# EAGLE design LED_addon_v6 (EAGLE 6.0)
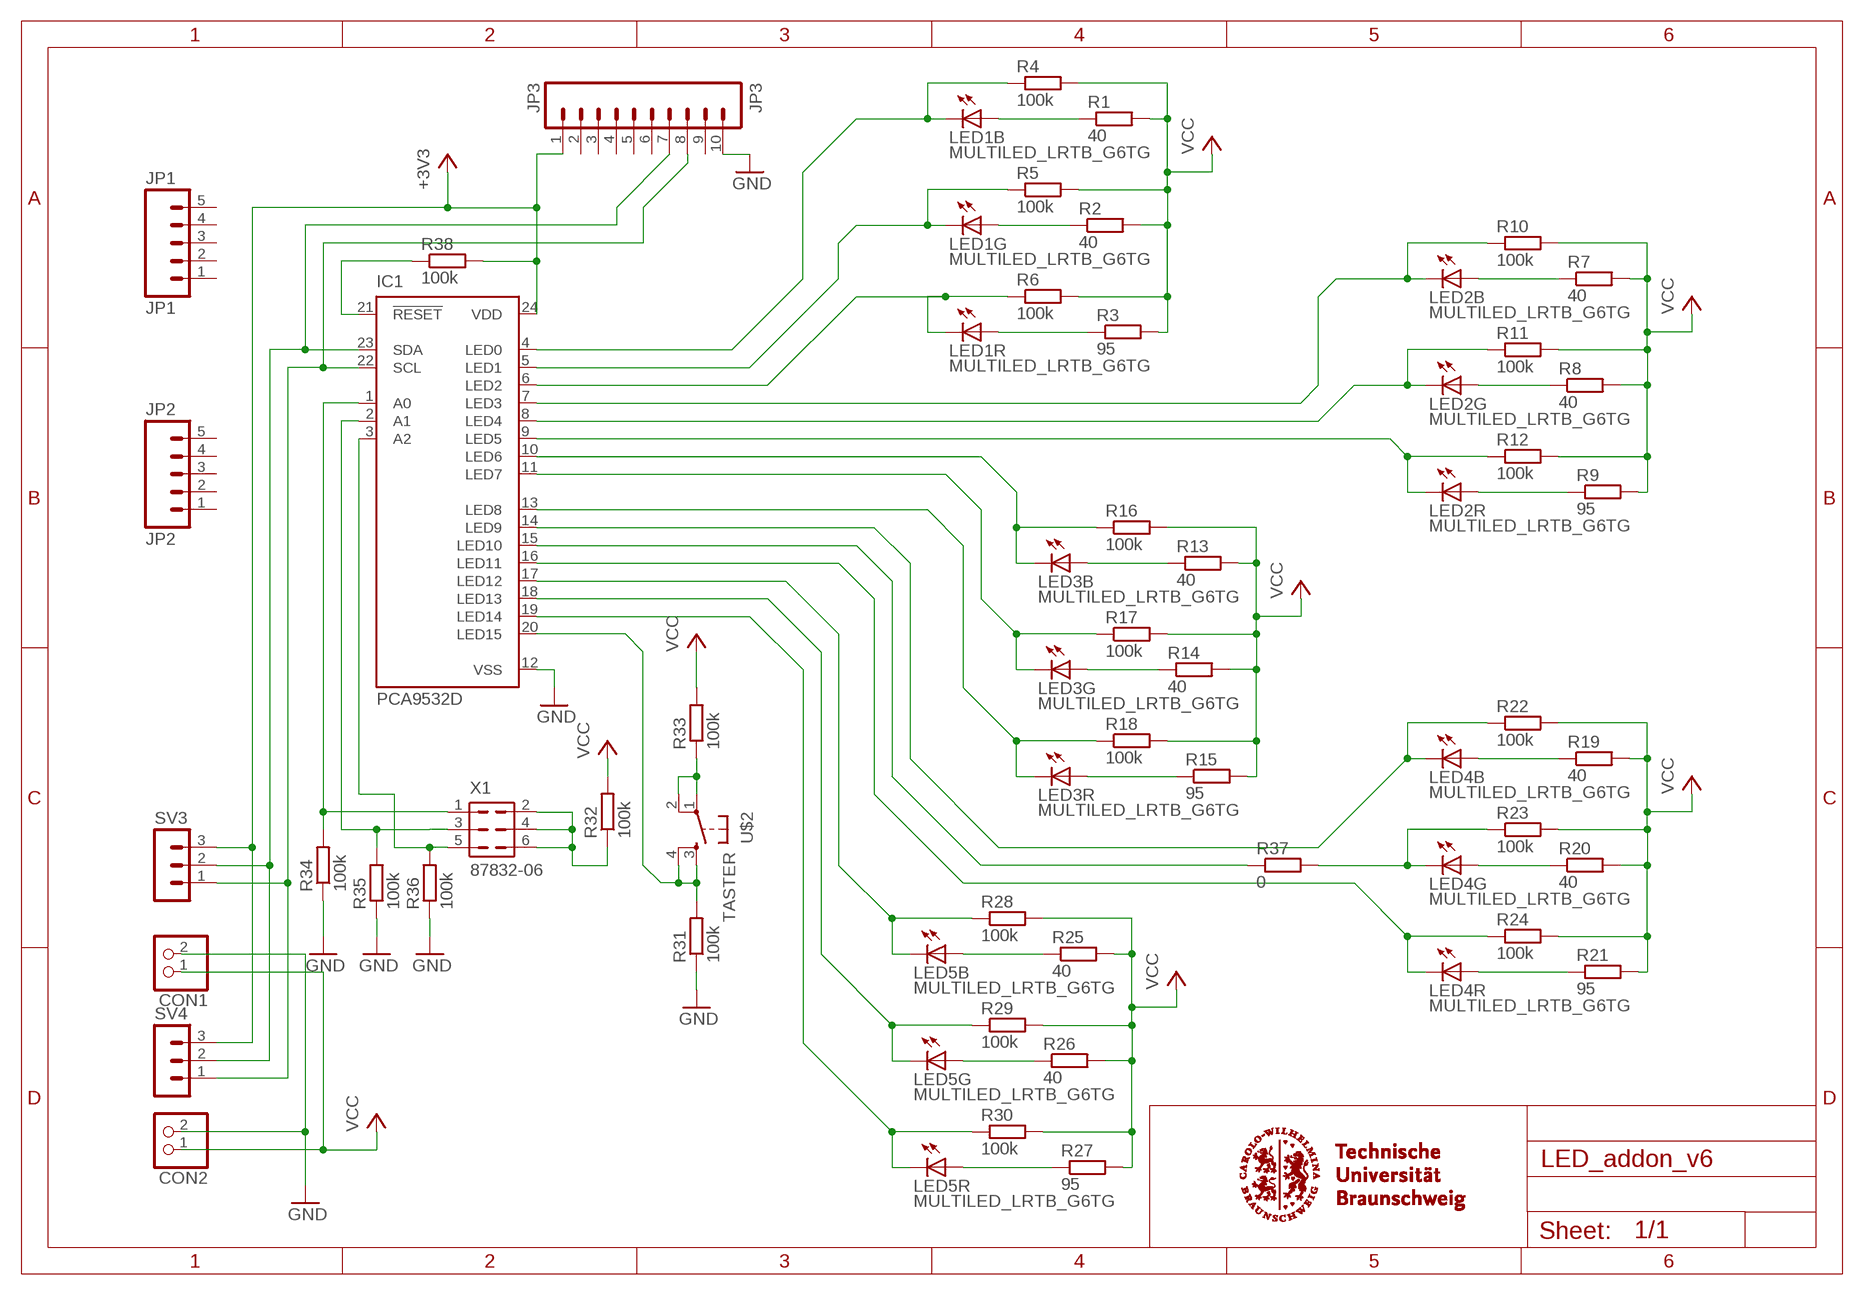
[diagram p0: schematic, sheet 1]

## Parts
CON1  PINHD-1X2  [1X02]
CON2  PINHD-1X2  [1X02]
IC1  PCA9532D  [SO24]
JP1  JP1  M05PTH  [1X05]
JP2  JP2  M05PTH  [1X05]
JP3  JP3  M10"  [1X10]
LED1  MULTILED_LRTB_G6TG  [P-LCC-6_TOPLED]
LED2  MULTILED_LRTB_G6TG  [P-LCC-6_TOPLED]
LED3  MULTILED_LRTB_G6TG  [P-LCC-6_TOPLED]
LED4  MULTILED_LRTB_G6TG  [P-LCC-6_TOPLED]
LED5  MULTILED_LRTB_G6TG  [P-LCC-6_TOPLED]
R1  40  R-EU_M0805  [M0805]
R2  40  R-EU_M0805  [M0805]
R3  95  R-EU_M0805  [M0805]
R4  100k  R-EU_M0805  [M0805]
R5  100k  R-EU_M0805  [M0805]
R6  100k  R-EU_M0805  [M0805]
R7  40  R-EU_M0805  [M0805]
R8  40  R-EU_M0805  [M0805]
R9  95  R-EU_M0805  [M0805]
R10  100k  R-EU_M0805  [M0805]
R11  100k  R-EU_M0805  [M0805]
R12  100k  R-EU_M0805  [M0805]
R13  40  R-EU_M0805  [M0805]
R14  40  R-EU_M0805  [M0805]
R15  95  R-EU_M0805  [M0805]
R16  100k  R-EU_M0805  [M0805]
R17  100k  R-EU_M0805  [M0805]
R18  100k  R-EU_M0805  [M0805]
R19  40  R-EU_M0805  [M0805]
R20  40  R-EU_M0805  [M0805]
R21  95  R-EU_M0805  [M0805]
R22  100k  R-EU_M0805  [M0805]
R23  100k  R-EU_M0805  [M0805]
R24  100k  R-EU_M0805  [M0805]
R25  40  R-EU_M0805  [M0805]
R26  40  R-EU_M0805  [M0805]
R27  95  R-EU_M0805  [M0805]
R28  100k  R-EU_M0805  [M0805]
R29  100k  R-EU_M0805  [M0805]
R30  100k  R-EU_R0603  [R0603]
R31  100k  R-EU_M0805  [M0805]
R32  100k  R-EU_M0805  [M0805]
R33  100k  R-EU_M0805  [M0805]
R34  100k  R-EU_M0805  [M0805]
R35  100k  R-EU_M0805  [M0805]
R36  100k  R-EU_M0805  [M0805]
R37  0  R-EU_M1206  [M1206]
R38  100k  R-EU_M0805  [M0805]
SV3  MA03-1  [MA03-1]
SV4  MA03-1  [MA03-1]
U$2  TASTER  [TASTER]
X1  87832-06  [87832-06]

## Nets
+3V3: IC1.24(VDD) JP3.1 R38.2 SV3.3 SV4.3
A0: IC1.1(A0) R34.2 X1.1
A1: IC1.2(A1) R35.2 X1.3
A2: IC1.3(A2) R36.2 X1.5
GND: CON1.2 CON2.2 IC1.12(VSS) JP3.10 R31.1 R34.1 R35.1 R36.1
LED1B: IC1.4(LED0) LED1.C3(B:C) R4.1
LED1G: IC1.5(LED1) LED1.C2(G:C) R5.1
LED1R: IC1.6(LED2) LED1.C1(R:C) R6.1
LED2B: IC1.7(LED3) LED2.C3(B:C) R10.1
LED2G: IC1.8(LED4) LED2.C2(G:C) R11.1
LED2R: IC1.9(LED5) LED2.C1(R:C) R12.1
LED3B: IC1.10(LED6) LED3.C3(B:C) R16.1
LED3G: IC1.11(LED7) LED3.C2(G:C) R17.1
LED3R: IC1.13(LED8) LED3.C1(R:C) R18.1
LED4B: IC1.14(LED9) LED4.C3(B:C) R22.1
LED4G: IC1.15(LED10) R37.1
LED4G2: LED4.C2(G:C) R23.1 R37.2
LED4R: IC1.16(LED11) LED4.C1(R:C) R24.1
LED5B: IC1.17(LED12) LED5.C3(B:C) R28.1
LED5G: IC1.18(LED13) LED5.C2(G:C) R29.1
LED5R: IC1.19(LED14) LED5.C1(R:C) R30.1
N$1: LED1.A3(B:A) R1.1
N$2: LED1.A2(G:A) R2.1
N$3: LED1.A1(R:A) R3.1
N$4: IC1.21(!RESET) R38.1
N$5: R33.1 U$2.1(P) U$2.2(P1)
N$7: R32.1 X1.2 X1.4 X1.6
N$10: LED2.A3(B:A) R7.1
N$11: LED2.A2(G:A) R8.1
N$12: LED2.A1(R:A) R9.1
N$19: LED3.A3(B:A) R13.1
N$20: LED3.A2(G:A) R14.1
N$23: LED3.A1(R:A) R15.1
N$25: LED4.A3(B:A) R19.1
N$26: LED4.A2(G:A) R20.1
N$27: LED4.A1(R:A) R21.1
N$35: LED5.A3(B:A) R25.1
N$36: LED5.A2(G:A) R26.1
N$37: LED5.A1(R:A) R27.1
SCL: IC1.22(SCL) JP3.8 SV3.1 SV4.1
SDA: IC1.23(SDA) JP3.7 SV3.2 SV4.2
SWITCH: IC1.20(LED15) R31.2 U$2.3(S) U$2.4(S1)
VCC: CON1.1 CON2.1 R1.2 R2.2 R3.2 R4.2 R5.2 R6.2 R7.2 R8.2 R9.2 R10.2 R11.2 R12.2 R13.2 R14.2 R15.2 R16.2 R17.2 R18.2 R19.2 R20.2 R21.2 R22.2 R23.2 R24.2 R25.2 R26.2 R27.2 R28.2 R29.2 R30.2 R32.2 R33.2
Unconnected: JP1.1 JP1.2 JP1.3 JP1.4 JP1.5 JP2.1 JP2.2 JP2.3 JP2.4 JP2.5 JP3.2 JP3.3 JP3.4 JP3.5 JP3.6 JP3.9

## Library data of the parts
CON1 CON2 = pinhead:PINHD-1X2: PIN HEADER
IC1 = PCA9532:PCA9532: 16-bit i2C-bus LED dimmer The PCA9532 is a 16-bit I2C-bus and SMBus I/O expander optimized for dimming LEDs in 256 discrete steps for Red/Green/Blue (RGB) color mixing and back light applications. The PCA9532 contains an internal oscillator with two user programmable blink rates and duty cycles coupled to the output PWM. The LED brightness is controlled by setting the blink rate high enough (> 100 Hz) that the blinking cannot be seen and then using the duty cycle to vary the amount of time the LED is on and thus the average current through the LED.
JP1 JP2 = SparkFun:M05: Header 5 Standard 5-pin 0.1" header. Use with straight break away headers (SKU : PRT-00116), right angle break away headers (PRT-00553), swiss pins (PRT-00743), machine pins (PRT-00117), and female headers (PRT-00115). Molex polarized connector foot print use with SKU : PRT-08230 with associated crimp pins and housings.
JP3 = SparkFun:M10: Header 10 Standard 10-pin 0.1" header. Use with straight break away headers (SKU : PRT-00116), right angle break away headers (PRT-00553), swiss pins (PRT-00743), machine pins (PRT-00117), and female headers (PRT-00115).
LED1-LED5 = led:MULTILED_LRTB_G6TG: 6-lead MULTILED® Enhanced optical Power LED (ThinFilm® / ThinGaN®) Source. OSRAM - LRTB_G6TG.pdf
R1-R38 = resistor:R-EU_: RESISTOR, European symbol
SV3 SV4 = con-lstb:MA03-1: PIN HEADER
U$2 = taster:TASTER: SMD Switch
X1 = con-molex:87832-06: Milli-Grid Header 2.00mm (.079") Pitch

## Board
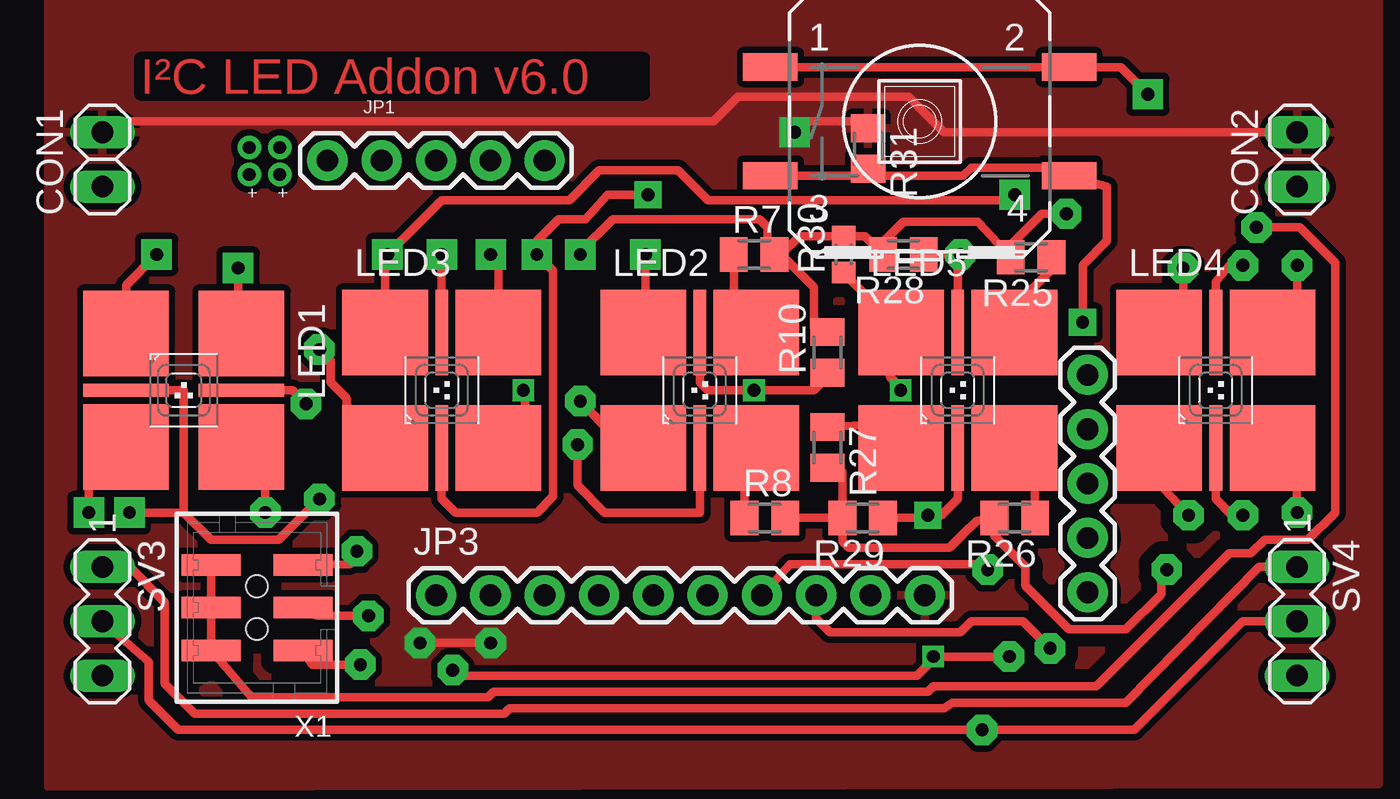
[diagram p1: board, top side]
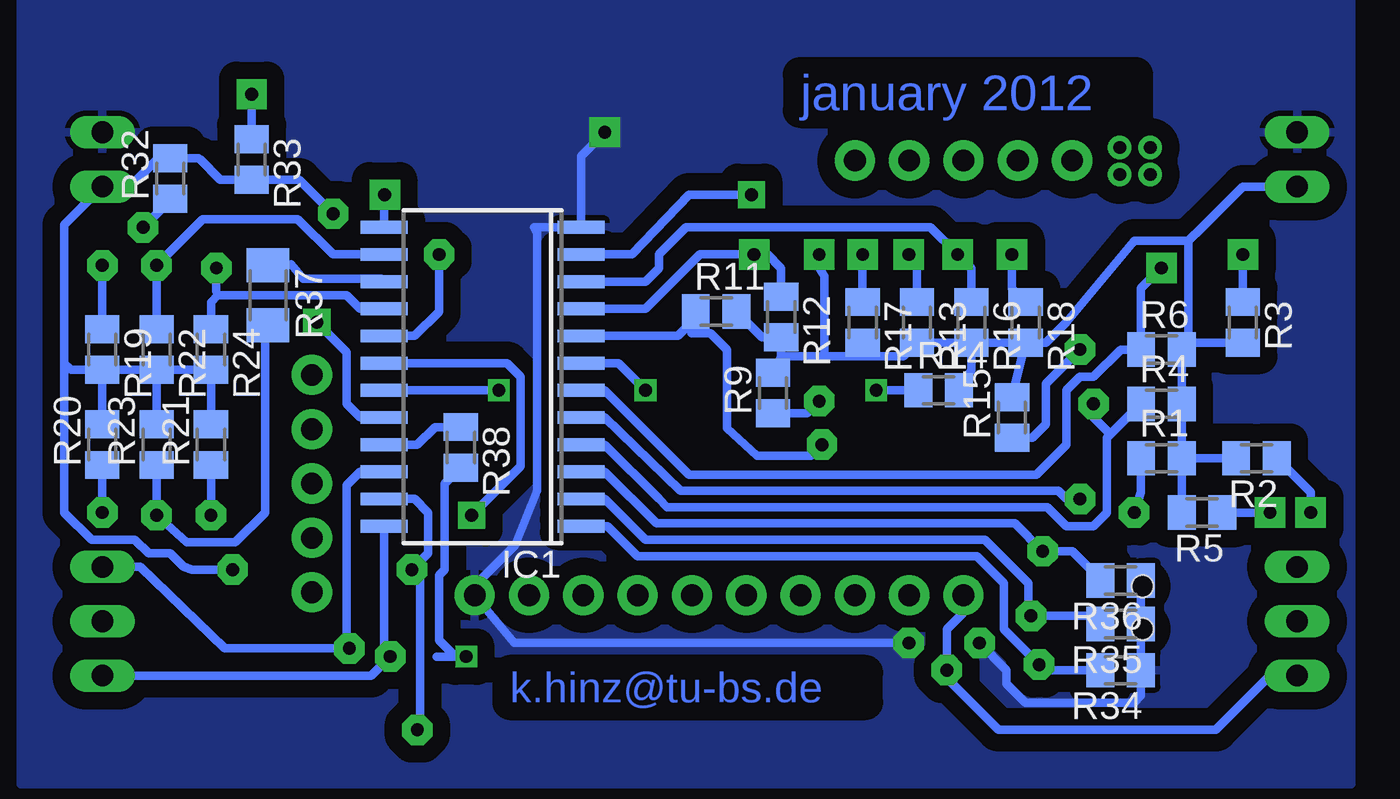
[diagram p2: board, bottom side, seen from below]

No outline drawn. Coordinates in mm, seen from the top.
Copper layers (1*16): Top 0.035mm / dielectric 1.5mm / Bottom 0.035mm
Design rules: minimum track width 16mil, minimum drill 32mil, track to track 12mil, track to pad 12mil, pad to pad 12mil, via to via 12mil, smd to smd 12mil, copper to edge 25mil, drill to drill 12mil, minimum pad ring 10mil, minimum via ring 8mil, stop-mask expansion 4mil, vias tented up to drill 0mil, thermal gap 10mil

### Footprints (pad centres in the part's own frame; a part is rotated, then mirrored left to right if it is on the bottom)
1X02 = drill 1.016 long: 1 -1.27,0; 2 1.27,0
SO24 = smd 0.6 x 2.2: 1 -6.985,-4.6; 2 -5.715,-4.6; 3 -4.445,-4.6; 4 -3.175,-4.6; 5 -1.905,-4.6; 6 -0.635,-4.6; 7 0.635,-4.6; 8 1.905,-4.6; 9 3.175,-4.6; 10 4.445,-4.6; 11 5.715,-4.6; 12 6.985,-4.6; 13 6.985,4.6; 14 5.715,4.6; 15 4.445,4.6; 16 3.175,4.6; 17 1.905,4.6; 18 0.635,4.6; 19 -0.635,4.6; 20 -1.905,4.6; 21 -3.175,4.6; 22 -4.445,4.6; 23 -5.715,4.6; 24 -6.985,4.6
1X05@1 = drill 1.016 pad 1.88: 1 0,0; 2 2.54,0; 3 5.08,0; 4 7.62,0; 5 10.16,0
1X10 = drill 1.016 pad 1.88: 1 0,0; 2 2.54,0; 3 5.08,0; 4 7.62,0; 5 10.16,0; 6 12.7,0; 7 15.24,0; 8 17.78,0; 9 20.32,0; 10 22.86,0
BATT = drill 0.6 pad 1.016: BATT_+ 0,0; BATT_GND 1.27,0
P-LCC-6_TOPLED = smd 4 x 4: A1 -2.65,-2.7; A2 2.65,-2.7; A3 2.65,2.7; C1 -2.65,2.7 | smd 0.6 x 4: C2 0,-2.7; C3 0,2.7
M0805 = smd 1.3 x 1.6: 1 -0.95,0; 2 0.95,0
R0603 = smd 1 x 1.1: 1 -0.85,0; 2 0.85,0
M1206 = smd 1.6 x 2: 1 -1.4,0; 2 1.4,0
MA03-1 = drill 1.016 long: 1 -2.54,0; 2 0,0; 3 2.54,0
TASTER = smd 2.54 x 1.27: 1 -6.985,2.54; 2 6.985,2.54; 3 -6.985,-2.54; 4 6.985,-2.54
87832-06 = smd 1 x 2.75: 1 -2,-2.15; 2 -2,2.15; 3 0,-2.15; 4 0,2.15; 5 2,-2.15; 6 2,2.15 | hole 1: -1,0; 1,0

### Placement (x,y rotation side)
CON1  22.86,38.1 90 top
CON2  78.74,38.1 90 top
IC1  60.96,27.94 90 bottom
JP1  JP1  [1X05@1]  33.38,38.05 0 top
JP2  JP2  [1X05@1]  68.94,17.87 90 top
JP3  38.46,17.73 0 top
JP4  Batt  [BATT]  29.73,37.39 90 top
JP5  Li-Ion  [BATT]  31.16,37.39 90 top
LED1  26.67,27.3 270 top
LED2  50.8,27.3 0 top
LED3  38.73,27.3 0 top
LED4  74.93,27.3 0 top
LED5  62.87,27.3 0 top
R1  29.21,24.13 0 bottom
R2  24.77,24.13 180 bottom
R3  25.4,30.48 270 bottom
R4  29.21,26.67 0 bottom
R5  27.3,21.59 180 bottom
R6  29.21,29.21 0 bottom
R7  53.34,33.66 0 top
R8  53.85,21.34 0 top
R9  47.37,27.18 90 bottom
R10  56.77,29.08 90 top
R11  50.04,30.99 0 bottom
R12  46.99,30.73 270 bottom
R13  40.64,30.48 270 bottom
R14  39.62,27.3 0 bottom
R15  36.2,26.04 90 bottom
R16  38.1,30.48 270 bottom
R17  43.18,30.48 270 bottom
R18  35.56,30.48 270 bottom
R19  78.74,29.21 270 bottom
R20  78.74,24.77 90 bottom
R21  73.66,24.77 90 bottom
R22  76.2,29.21 270 bottom
R23  76.2,24.77 90 bottom
R24  73.66,29.21 270 bottom
R25  66.29,33.53 180 top
R26  65.53,21.34 180 top
R27  56.77,24.64 270 top
R28  60.33,33.66 180 top
R29  58.42,21.34 180 top
R30  57.53,33.66 90 top
R31  58.67,38.61 270 top
R32  75.56,37.21 90 bottom
R33  71.75,38.1 270 bottom
R34  31.11,14.22 180 bottom
R35  31.11,16.38 180 bottom
R36  31.11,18.41 180 bottom
R37  70.99,31.75 270 bottom
R38  61.98,24.64 270 bottom
SV3  22.86,16.51 270 top
SV4  78.74,16.51 270 top
U$2  61.09,39.88 0 top
X1  30.1,17.14 90 top

### Tracks (layer width: path | path; a pad name or v marks a point on that pad's centre or on a via)
+3V3  (via drill 0.6, 0.6 pad 1.42)
  Top 0.406: v65.28,14.86 v61.72,14.86 61.85,14.86 60.96,13.97 39.75,13.97 v39.24,14.22
  Bottom 0.406: 65.56,14.63 65.56,14.58 | 65.56,14.63 IC1.24 | 65.56,14.58 66.17,13.97 SV4.3 | SV3.3 24.13,13.97 26.67,11.43 36.83,11.43 39.24,13.84 v39.24,14.22 39.24,16.13 38.48,16.89 38.48,17.74 JP3.1 | 65.56,14.63 65.56,14.58 | v65.28,14.86 65.56,14.63 | R38.2 62.74,22.93 62.74,21.46 62.74,18.92 62.99,18.67 62.99,15.62 62.87,15.49 62.23,14.86 v61.72,14.86 63.12,14.86
A0  (via drill 0.6 pad 1.42)
  Top 0.406: X1.1 32.66,14.48 v34.92,14.48
  Bottom 0.406: IC1.1 55.12,20.95 53.72,19.56 38.73,19.56 37.85,19.56 36.58,18.29 36.58,16.13 v34.92,14.48 34.67,14.22 R34.2
A1  (via drill 0.6 pad 1.42)
  Top 0.406: X1.3 32.88,16.76 v35.31,16.76
  Bottom 0.406: IC1.2 55.24,22.23 53.34,20.32 39.37,20.32 37.47,20.32 35.43,18.29 35.43,16.89 v35.31,16.76 32.45,16.76 R35.2
A2  (via drill 0.6 pad 1.42)
  Top 0.406: X1.5 34.42,19.18 34.77,19.53 v34.77,19.78
  Bottom 0.406: IC1.3 55.24,23.5 52.83,21.08 39.88,21.08 36.07,21.08 v34.77,19.78 33.37,19.78 32.13,18.54 32.16,18.51 R36.2
GND  (via drill 0.6 pad 1.42)
  Top 0.406: 58.49,39.88 R31.1 | v41.02,15.49 40.26,15.49 v37.72,15.49 | 55.24,39.88 58.49,39.88 | 55.24,39.88 58.49,39.88 | v55.24,39.37 55.24,39.88 | CON1.2 23.37,39.88 45.59,39.88 51.44,39.88 52.58,41.02 60.58,41.02 60.96,40.64 62.23,39.37 CON2.2
  Bottom 0.406: R36.1 R35.1 R34.1 30.16,13.02 30.48,12.7 35.05,12.7 35.56,12.7 36.45,13.59 36.45,14.22 v37.72,15.49 | v55.24,39.37 56.36,38.26 IC1.12 58.55,34.92 58.42,34.67 58.42,22.61 59.44,20.07 61.32,18.18 JP3.10 59.47,15.49 v41.02,15.49
  pour Bottom (isolate 0.813): 20.32,46.99 82.55,46.99 82.55,8.89 20.32,8.89
  pour Top (isolate 0.305): 82.55,46.99 82.55,8.89 20.32,8.76 20.32,46.99
  pour Top (isolate 0.813): 20.32,46.99 82.55,46.99 82.55,8.89 20.32,8.89
LED1B  (via drill 0.6 pad 1.42)
  Top 0.406: LED1.C3 31.75,27.3 v32.38,26.67
  Bottom 0.406: IC1.4 55.24,24.77 52.7,22.23 52.32,21.84 34.54,21.84 33.66,20.95 32.38,20.95 31.75,21.59 31.75,24.13 31.75,25.08 31.59,25.24 | 31.59,25.24 R4.1 | v32.38,26.67 32.38,26.04 31.59,25.24
LED1G  (via drill 0.6 pad 1.42)
  Top 0.406: LED1.C2 26.67,27.3 26.67,22.86 26.67,21.59 | 26.67,21.59 27.94,20.32 29.21,20.32 30.48,20.32 31.11,20.32 v33.02,22.23 | v24.13,21.59 24.77,21.59 26.67,21.59
  Bottom 0.406: IC1.5 55.24,26.04 51.69,22.61 34.04,22.61 33.66,22.23 v33.02,22.23 | v24.13,21.59 R5.1
LED1R  (via drill 0.6 pad 1.42)
  Top 0.406: v29.21,33.02 29.21,30.11 LED1.C1
  Bottom 0.406: IC1.6 55.24,27.3 51.31,23.37 35.05,23.37 33.66,24.77 33.66,27.3 33.02,27.94 32.38,27.94 31.11,29.21 R6.1 30.16,32.07 v29.21,33.02
LED2B  (via drill 0.6 pad 1.02)
  Top 0.406: LED2.C3 50.8,27.69 51.18,27.3 v53.34,27.3 56.13,27.3 56.77,27.94 R10.1
  Bottom 0.406: IC1.7 54.61,28.57 v53.34,27.3
LED2G  (via drill 0.6 pad 1.42)
  Top 0.406: LED2.C2 50.8,21.59 46.35,21.59 45.09,22.86 v45.09,24.77
  Bottom 0.406: R11.1 50.99,30.48 50.8,30.48 50.8,31.37 51.18,31.37 51.18,30.48 | 51.18,30.48 51.18,29.97 50.29,29.97 49.53,29.21 49.53,25.53 48.13,24.26 45.85,24.26 45.59,24.26 v45.09,24.77 | IC1.8 51.82,29.84 51.18,30.48
LED2R  (via drill 0.6 pad 1.42)
  Top 0.406: v48.26,33.66 48.26,33.02 48.26,31.75 48.26,30.11 LED2.C1
  Bottom 0.406: IC1.9 53.34,31.11 50.8,33.66 v48.26,33.66 47.62,33.66 46.99,33.02 R12.1
LED3B  (via drill 0.6 pad 1.42)
  Top 0.406: LED3.C3 38.73,32.38 v38.73,33.66
  Bottom 0.406: IC1.10 53.34,32.38 52.7,33.02 52.7,33.66 51.44,34.92 45.09,34.92 40.01,34.92 v38.73,33.66 38.1,33.02 R16.1
LED3G  (via drill 0.6 pad 1.27, 0.6 pad 1.42)
  Top 0.406: LED3.C2 38.73,22.23 39.37,21.59 43.18,21.59 43.94,22.35 43.94,32.89 v43.18,33.66 43.18,34.29 44.2,35.31 45.47,35.31 46.48,36.45 v48.39,36.45
  Bottom 0.406: v43.18,33.66 R17.1 | IC1.11 53.98,33.66 51.31,36.45 v48.39,36.45
LED3R  (via drill 0.6 pad 1.42)
  Top 0.406: v65.53,36.45 65.15,36.2 51.18,36.2 49.78,37.59 49.53,37.59 46.1,37.59 44.7,36.2 44.45,36.2 43.18,36.2 40.01,36.2 38.73,36.2 v36.2,33.66 36.09,33.55 LED3.C1
  Bottom 0.406: R18.1 36.2,32.06 v36.2,33.66 | IC1.13 65.56,36.29 v65.53,36.45
LED4B  (via drill 0.6 pad 1.42)
  Top 0.406: v76.2,33.15 75.56,33.15 74.93,32.38 LED4.C3
  Bottom 0.406: R22.1 v76.2,33.15 74.04,35.31 69.6,35.31 67.94,33.66 IC1.14
LED4G
  Bottom 0.406: IC1.15 65.69,32.51 67.18,32.51 69.34,32.51 69.91,33.21 R37.1
LED4G2  (via drill 0.6 pad 1.42)
  Top 0.406: LED4.C2 74.93,22.23 75.69,21.46 v76.2,21.46
  Bottom 0.406: R23.1 v76.2,21.46 74.8,20.19 72.52,20.19 71.12,21.59 71.12,29.21 71.12,30.1 R37.2
LED4R  (via drill 0.6 pad 1.42)
  Top 0.406: v73.41,33.02 73.42,31.48 LED4.C1
  Bottom 0.406: IC1.16 66.67,31.11 67.31,31.75 73.34,31.75 | 73.34,31.75 73.66,31.43 73.66,31.11 R24.1 | 73.34,31.75 73.41,31.94 v73.41,33.02
LED5B  (via drill 0.6 pad 1.42)
  Top 0.406: LED5.C3 62.87,33.53 v62.99,33.66 | v62.99,33.66 63.12,33.66 v62.99,33.66 | v62.99,33.66 R28.1
  Bottom 0.406: IC1.17 64.14,29.84 62.99,30.99 v62.99,33.66
LED5G  (via drill 0.6 pad 1.27)
  Top 0.406: LED5.C2 62.87,22.23 62.1,21.46 v61.47,21.46 61.21,21.34 R29.1
  Bottom 0.406: IC1.18 59.82,28.57 59.18,27.94 59.18,23.75 v61.47,21.46
LED5R  (via drill 0.6 pad 1.02)
  Top 0.406: v60.2,27.3 60.33,27.3 59.69,27.94 59.69,29.48 LED5.C1 60.22,30.12 R30.1
  Bottom 0.406: v60.2,27.3 IC1.19
N$1  (via drill 0.6 pad 1.42)
  Top 0.406: v30.48,21.59 30.48,23.55 LED1.A3
  Bottom 0.406: R1.1 30.16,22.55 v30.48,21.59
N$2  (via drill 0.6 pad 1.42)
  Top 0.406: v22.23,21.59 22.23,22.91 LED1.A2
  Bottom 0.406: R2.1 22.23,22.54 v22.23,21.59
N$3  (via drill 0.6 pad 1.42)
  Top 0.406: LED1.A1 23.97,32.23 v25.4,33.66
  Bottom 0.406: v25.4,33.66 R3.1
N$4
  Bottom 0.406: IC1.21 64.01,24.77 63.19,25.59 R38.1
N$5  (via drill 0.6 pad 1.42)
  Top 0.406: U$2.1 U$2.2 70.48,42.42 v71.75,41.15
  Bottom 0.406: v71.75,41.15 R33.1
N$7  (via drill 0.6 pad 1.42)
  Top 0.406: X1.6 X1.4 X1.2 29.5,13.34 29.84,12.95 35.94,12.95 37.85,12.95 40.89,12.95 41.15,13.21 61.47,13.21 61.72,13.46 69.34,13.46 75.56,19.68 76.58,19.68 77.22,20.32 79.25,20.32 80.52,21.59 80.52,33.27 78.87,34.92 77.09,34.92 v76.83,34.92
  Bottom 0.406: v76.83,34.92 75.56,36.2 R32.1
N$8
  pour Top (isolate 0.61): 82.55,46.99 82.55,8.89 20.32,8.89
N$10
  Top 0.406: LED2.A3 52.39,31.07 R7.1
N$11
  Top 0.406: R8.1 52.9,23.93 LED2.A2
N$12  (via drill 0.6 pad 1.42)
  Top 0.406: v45.21,26.8 46.85,25.15 LED2.A1
  Bottom 0.406: R9.1 45.79,26.23 v45.21,26.8
N$19  (via drill 0.6 pad 1.42)
  Top 0.406: LED3.A3 41.38,33.29 v41.02,33.66
  Bottom 0.406: v41.02,33.66 40.64,33.27 R13.1
N$20  (via drill 0.6 pad 1.02)
  Top 0.406: LED3.A2 42.67,26.4 v42.55,27.3
  Bottom 0.406: R14.1 v42.55,27.3
N$23  (via drill 0.6 pad 1.42)
  Top 0.406: LED3.A1 35.29,25.4 34.92,25.4 34.29,26.67 34.29,26.92 33.53,27.69 33.53,28.7 v33.02,29.21
  Bottom 0.406: R15.1 35.24,25.09 34.61,25.72 34.61,27.62 v33.02,29.21
N$25  (via drill 0.6 pad 1.42)
  Top 0.406: v78.74,33.15 78.74,31.16 LED4.A3
  Bottom 0.406: v78.74,33.15 R19.1
N$26  (via drill 0.6 pad 1.42)
  Top 0.406: v78.74,21.59 78.72,23 LED4.A2
  Bottom 0.406: v78.74,21.59 R20.1
N$27  (via drill 0.6 pad 1.42)
  Top 0.406: v73.66,21.46 72.28,22.97 LED4.A1
  Bottom 0.406: v73.66,21.46 R21.1
N$35
  Top 0.406: LED5.A3 65.52,31.23 67.31,33.02 66.99,33.02 R25.1
N$36
  Top 0.406: LED5.A2 66.48,23.26 R26.1
N$37
  Top 0.406: LED5.A1 59.1,25.71 R27.1
SCL  (via drill 0.6 pad 1.42)
  Top 0.406: JP3.8 56.24,16.65 56.9,16 62.61,16 62.99,16 63.5,16.51 65.91,16.51 66.42,16 v67.18,15.24 | SV3.1 24.13,19.05 25.78,17.4 25.78,13.59 27.18,12.19 37.21,12.19 41.66,12.19 41.91,12.45 62.23,12.45 62.61,12.7 70.74,12.7 76.96,19.05 SV4.1
  Bottom 0.406: IC1.22 66.67,23.5 67.31,22.86 67.31,16.38 67.31,15.37 v67.18,15.24 68.07,15.24 73.03,15.24 76.96,19.05 SV4.1
SDA  (via drill 0.6 pad 1.42)
  Top 0.406: JP3.7 55.03,19.18 64.01,19.18 v64.26,18.92 | SV3.2 25.02,14.61 25.02,13.34 25.02,12.83 26.42,11.43 v64.01,11.43 71.12,11.43 73.91,14.22 74.93,15.24 76.2,16.51 SV4.2
  Bottom 0.406: IC1.23 64.14,22.23 63.5,21.59 63.5,20.07 63.5,19.68 v64.26,18.92 63.88,18.54 63.88,11.56 v64.01,11.43
SWITCH  (via drill 0.6 pad 1.27)
  Top 0.406: v68.71,30.48 68.71,31.88 68.71,33.15 69.85,34.29 69.85,36.83 U$2.4 67.69,37.72 67.06,37.72 66.42,37.72 63.5,37.72 63.12,37.34 62.87,37.34 58.93,37.34 | U$2.3 58.93,37.34 | R31.2 58.86,37.59 58.93,37.34
  Bottom 0.406: IC1.20 66.67,26.04 67.31,26.67 67.31,29.08 v68.71,30.48
VCC  (via drill 0.6 pad 1.42)
  Top 0.406: R29.2 R8.2 | R27.2 57.47,23.5 R29.2 | R29.2 57.47,20.25 57.78,19.94 61.79,19.94 62.48,19.94 63.12,20.57 63.75,21.21 R26.2 64.58,20.51 66.04,19.05 66.04,18.16 67.69,16.51 68.07,16.13 70.74,16.13 72.39,17.78 72.39,18.67 v72.64,18.92 | 54.61,33.66 R7.2 54.61,33.66 | 54.61,33.66 55.24,33.02 56.13,32.13 | 56.13,32.13 56.13,30.23 | 56.13,30.23 56.52,29.84 | 56.52,29.84 56.84,29.84 | 56.84,29.84 R10.2 | 56.13,32.13 56.13,30.23 | 54.61,33.66 56.13,32.13 | 54.61,33.66 53.98,33.66 53.98,34.92 53.59,35.31 46.74,35.31 45.21,33.78 v45.21,33.66 | 56.52,29.84 56.84,29.84 | 56.13,30.23 56.52,29.84 | 56.13,32.13 56.13,30.23 | 54.61,33.66 56.13,32.13 | 54.61,33.66 55.46,34.51 R30.2 58.52,34.51 R28.2 59.38,34.23 60.33,35.18 63.82,35.18 R25.2 65.34,34.1 66.17,34.92 66.8,35.56 v67.94,35.56
  Bottom 0.406: R19.2 R22.2 | R22.2 R24.2 R21.2 | R19.2 R20.2 | R22.2 R23.2 | 46.99,28.89 R9.2 | 46.99,28.89 R12.2 47.88,29.78 R11.2 | 43.18,28.89 41.27,28.89 R13.2 R16.2 | 43.18,28.89 44.96,28.89 | 44.96,28.89 46.99,28.89 | R18.2 R16.2 | 43.18,28.89 R17.2 | R14.2 38.1,28.26 R16.2 | R18.2 R15.2 | 44.96,28.89 44.96,32.64 45.21,33.02 v45.21,33.66 | R18.2 34.6,29.53 33.66,30.48 30.48,34.29 27.94,34.29 | 27.94,29.53 27.94,34.29 | 27.94,29.53 R6.2 R4.2 R1.2 | 27.94,29.53 R3.2 | 27.94,34.29 27.3,34.92 25.4,36.83 24.51,36.83 CON1.1 | R5.2 R1.2 | v67.94,35.56 69.53,37.15 R33.2 73.22,37.15 74.17,38.1 74.23,38.16 R32.2 76.14,38.16 77.47,36.83 CON2.1 80.52,35.05 80.52,28.57 | 80.52,28.57 80.52,21.59 79.25,20.32 78.74,20.32 77.22,20.32 76.58,19.68 75.56,19.68 74.93,19.05 74.55,18.92 v72.64,18.92 | 80.52,28.57 80.2,28.26 R19.2 | R2.2 R1.2

### Text on the board
Top: I²C LED Addon v6.0
Bottom: january 2012 | k.hinz@tu-bs.de
tFinish: 1 | - | JP1 | JP2 | 1